# Altium project radxa_c200_io_board_v1.11.PrjPcb (part 4 of 8)

## Sheet 11_USB3.1 x4 HUB.SchDoc: C200
size 439 x 311 mm; Page Create Date: March  8, 1995; Page Number: 11; Page Size: Custom; Comment: radxa_1010; Page Count: 21; RevCode: V1.11; Doc: 11_USB3.1 x4 HUB; DsnPath: D:\WMS\C200\CC122\对外\C200 V1.11.DSN; SchematicName: c200; PageName: 11_USB3.1 x4 HUB; PageSize: Custom; TopSchematic: True
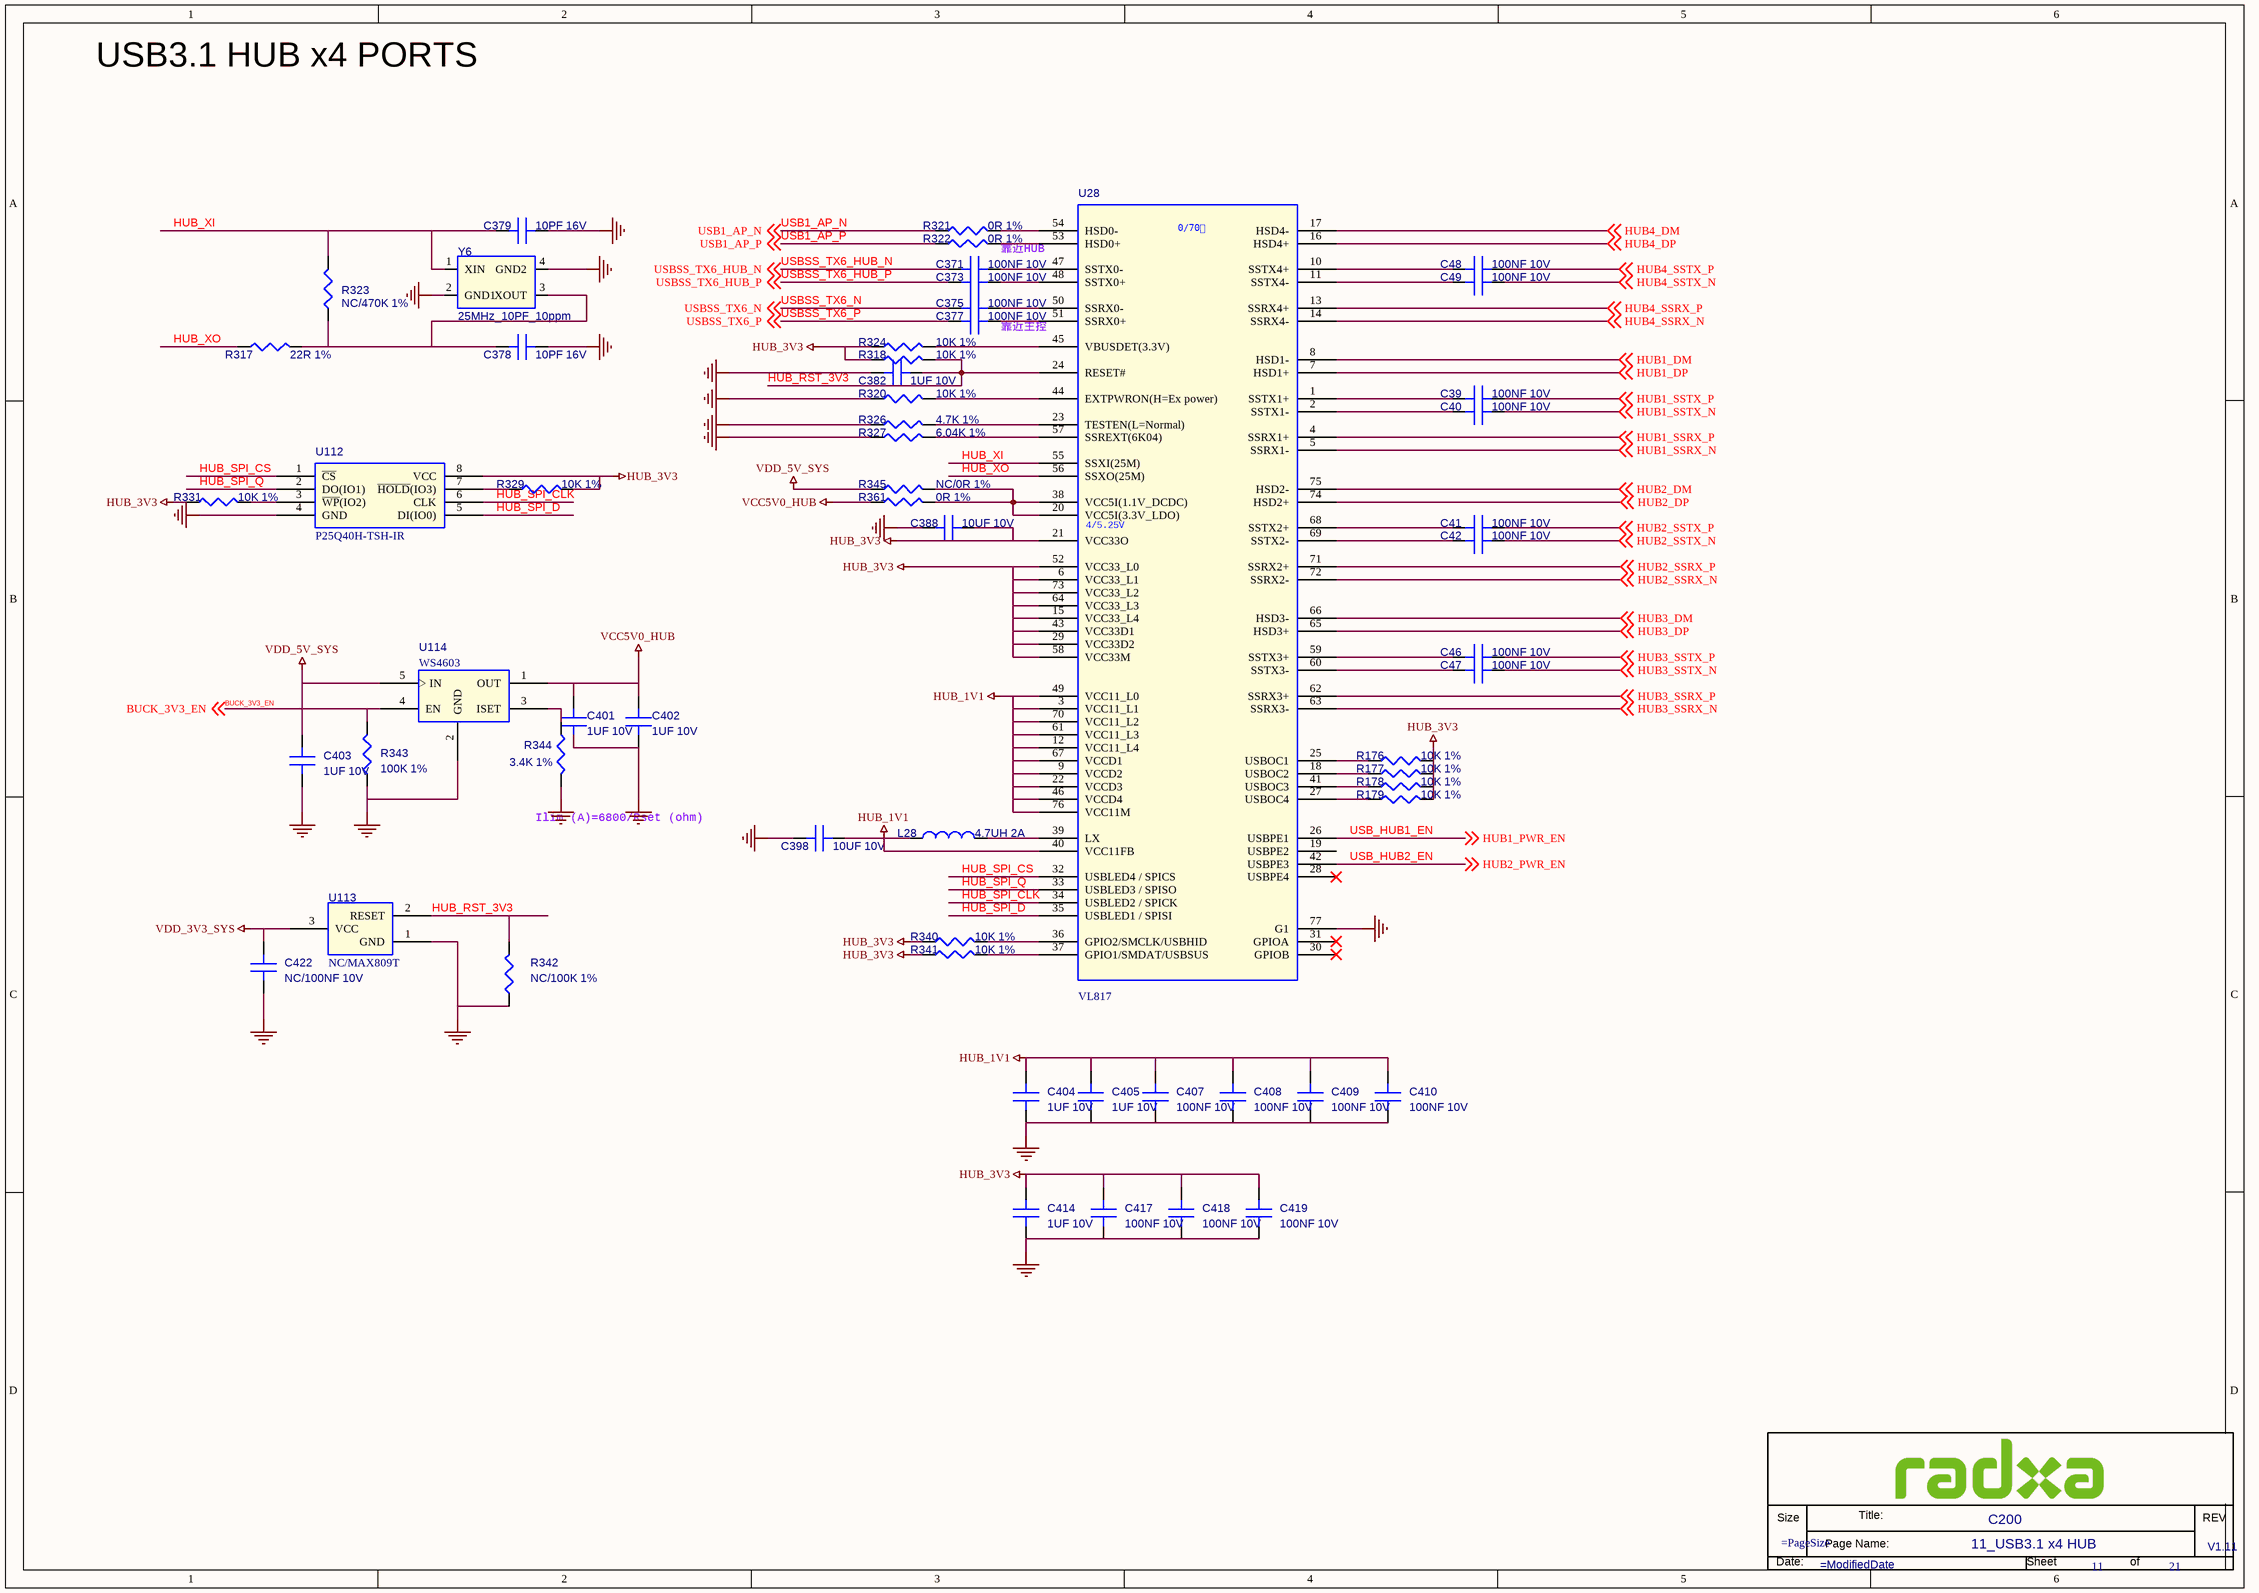
[diagram p23: 11_USB3.1 x4 HUB.SchDoc]

### Parts
(Parts that share a designator on the sheet are numbered #1, #2 ... from top to bottom, then left to right.)
*#10  Doc: 11_USB3.1 x4 HUB  RevCode: V1.11  Title: C200  Page Number: 11  Page Count: 21  (hidden comment: radxa_1010)  (graphical)
C39  100NF 10V  [C0402]
C40  100NF 10V  [C0402]
C41  100NF 10V  [C0402]
C42  100NF 10V  [C0402]
C46  100NF 10V  [C0402]
C47  100NF 10V  [C0402]
C48  100NF 10V  [C0402]
C49  100NF 10V  [C0402]
C371  100NF 10V  [C0402]
C373  100NF 10V  [C0402]
C375  100NF 10V  [C0402]
C377  100NF 10V  [C0402]
C378  10PF 16V  [C0402]
C379  10PF 16V  [C0402]
C382  1UF 10V  [C0402]
C388  10UF 10V  [C0603]
C398  10UF 10V  [C0603]
C401  1UF 10V  [C0402]
C402  1UF 10V  [C0402]
C403  1UF 10V  [C0402]
C404  1UF 10V  [C0402]
C405  1UF 10V  [C0402]
C407  100NF 10V  [C0402]
C408  100NF 10V  [C0402]
C409  100NF 10V  [C0402]
C410  100NF 10V  [C0402]
C414  1UF 10V  [C0402]
C417  100NF 10V  [C0402]
C418  100NF 10V  [C0402]
C419  100NF 10V  [C0402]
C422  NC/100NF 10V  [C0402]
L28  4.7UH 2A  [L_2520]
R176  10K 1%  [R0402]
R177  10K 1%  [R0402]
R178  10K 1%  [R0402]
R179  10K 1%  [R0402]
R317  22R 1%  [R0402]
R318  10K 1%  [R0402]
R320  10K 1%  [R0402]
R321  0R 1%  [R0402]
R322  0R 1%  [R0402]
R323  NC/470K 1%  [R0402]
R324  10K 1%  [R0402]
R326  4.7K 1%  [R0402]
R327  6.04K 1%  [R0402]
R329  10K 1%  [R0402]
R331  10K 1%  [R0402]
R340  10K 1%  [R0402]
R341  10K 1%  [R0402]
R342  NC/100K 1%  [R0402]
R343  100K 1%  [R0402]
R344  3.4K 1%  [R0402]
R345  NC/0R 1%  [R0402]
R361  0R 1%  [R0402]
U28  VL817  [QFN76E-PH04-9x9mm]
U112  P25Q40H-TSH-IR  [TSSOP8_0D65_4]
U113  NC/MAX809T  [SOT_23]
U114  WS4603  [SOT23_5]
Y6  25MHz_10PF_10ppm  [CRY-3225]

### Nets
GND: C378.1(A) C379.1(A) C382.1(A) C388.2(B) C398.2(B) C401.2(B) C402.2(B) C403.1(A) C404.2(B) C405.2(B) C407.2(B) C408.2(B) C409.2(B) C410.2(B) C414.2(B) C417.2(B) C418.2(B) C419.2(B) C422.2(B) R320.2 R326.2 R327.2 R342.2 R343.1 R344.1 U28.77(G1) U112.4(GND) U113.1(GND) U114.2(GND) Y6.2(GND1) Y6.4(GND2)  [project net HUB2_SSTX_N_J25]
HUB_1V1: C398.1(A) C404.1(A) C405.1(A) C407.1(A) C408.1(A) C409.1(A) C410.1(A) L28.1 U28.3(VCC11_L1) U28.9(VCCD2) U28.12(VCC11_L4) U28.22(VCCD3) U28.40(VCC11FB) U28.46(VCCD4) U28.49(VCC11_L0) U28.61(VCC11_L3) U28.67(VCCD1) U28.70(VCC11_L2) U28.76(VCC11M)
HUB_3V3: C388.1(A) C414.1(A) C417.1(A) C418.1(A) C419.1(A) R176.2 R177.2 R178.2 R179.2 R318.2 R324.2 R329.1 R331.2 R340.2 R341.2 U28.6(VCC33_L1) U28.15(VCC33_L4) U28.21(VCC33O) U28.29(VCC33D2) U28.43(VCC33D1) U28.52(VCC33_L0) U28.58(VCC33M) U28.64(VCC33_L3) U28.73(VCC33_L2) U112.8(VCC)
VCC5V0_HUB: C401.1(A) C402.1(A) R361.2 U114.1(OUT)
VDD_3V3_SYS: C422.1(A) U113.3(VCC)  [project net 3V3]
VDD_5V_SYS: C403.2(B) R345.2 U114.5(IN)  [project net PC_LED+]
BUCK_3V3_EN: R343.2 U114.4(EN) ; off-sheet BUCK_3V3_EN
HUB1_DM: U28.8(HSD1-) ; off-sheet HUB1_DM
HUB1_DP: U28.7(HSD1+) ; off-sheet HUB1_DP
HUB1_PWR_EN: U28.26(USBPE1) ; off-sheet HUB1_PWR_EN  [also labelled USB_HUB1_EN]
HUB1_SSRX_N: U28.5(SSRX1-) ; off-sheet HUB1_SSRX_N
HUB1_SSRX_P: U28.4(SSRX1+) ; off-sheet HUB1_SSRX_P
HUB1_SSTX_N: C40.2(B) ; off-sheet HUB1_SSTX_N
HUB1_SSTX_P: C39.2(B) ; off-sheet HUB1_SSTX_P
HUB2_DM: U28.75(HSD2-) ; off-sheet HUB2_DM
HUB2_DP: U28.74(HSD2+) ; off-sheet HUB2_DP
HUB2_PWR_EN: U28.42(USBPE3) ; off-sheet HUB2_PWR_EN  [also labelled USB_HUB2_EN]
HUB2_SSRX_N: U28.72(SSRX2-) ; off-sheet HUB2_SSRX_N
HUB2_SSRX_P: U28.71(SSRX2+) ; off-sheet HUB2_SSRX_P
HUB2_SSTX_N: C42.2(B) ; off-sheet HUB2_SSTX_N
HUB2_SSTX_P: C41.2(B) ; off-sheet HUB2_SSTX_P
HUB3_DM: U28.66(HSD3-) ; off-sheet HUB3_DM
HUB3_DP: U28.65(HSD3+) ; off-sheet HUB3_DP
HUB3_SSRX_N: U28.63(SSRX3-) ; off-sheet HUB3_SSRX_N
HUB3_SSRX_P: U28.62(SSRX3+) ; off-sheet HUB3_SSRX_P
HUB3_SSTX_N: C47.2(B) ; off-sheet HUB3_SSTX_N
HUB3_SSTX_P: C46.2(B) ; off-sheet HUB3_SSTX_P
HUB4_DM: U28.17(HSD4-) ; off-sheet HUB4_DM
HUB4_DP: U28.16(HSD4+) ; off-sheet HUB4_DP
HUB4_SSRX_N: U28.14(SSRX4-) ; off-sheet HUB4_SSRX_N
HUB4_SSRX_P: U28.13(SSRX4+) ; off-sheet HUB4_SSRX_P
HUB4_SSTX_N: C49.2(B) ; off-sheet HUB4_SSTX_N
HUB4_SSTX_P: C48.2(B) ; off-sheet HUB4_SSTX_P
HUB_RST_3V3: C382.2(B) R318.1 R342.1 U28.24(RESET#) U113.2(RESET)
HUB_SPI_CLK: U28.34(USBLED2_/_SPICK) U112.6(CLK)
HUB_SPI_CS: U28.32(USBLED4_/_SPICS) U112.1(~{CS})
HUB_SPI_D: U28.35(USBLED1_/_SPISI) U112.5(DI(IO0))
HUB_SPI_Q: U28.33(USBLED3_/_SPISO) U112.2(DO(IO1))
HUB_XI: C379.2(B) R323.1 U28.55(SSXI(25M)) Y6.1(XIN)
HUB_XO: R317.2 U28.56(SSXO(25M))
USB1_AP_N: R321.2 ; off-sheet USB1_AP_N
USB1_AP_P: R322.2 ; off-sheet USB1_AP_P
USBSS_TX6_HUB_N: C371.2(B) ; off-sheet USBSS_TX6_HUB_N
USBSS_TX6_HUB_P: C373.2(B) ; off-sheet USBSS_TX6_HUB_P
USBSS_TX6_N: C375.2(B) ; off-sheet USBSS_TX6_N
USBSS_TX6_P: C377.2(B) ; off-sheet USBSS_TX6_P
NetC39_1: C39.1(A) U28.1(SSTX1+)
NetC40_1: C40.1(A) U28.2(SSTX1-)
NetC41_1: C41.1(A) U28.68(SSTX2+)
NetC42_1: C42.1(A) U28.69(SSTX2-)
NetC46_1: C46.1(A) U28.59(SSTX3+)
NetC47_1: C47.1(A) U28.60(SSTX3-)
NetC48_1: C48.1(A) U28.10(SSTX4+)
NetC49_1: C49.1(A) U28.11(SSTX4-)
NetC371_1: C371.1(A) U28.47(SSTX0-)
NetC373_1: C373.1(A) U28.48(SSTX0+)
NetC375_1: C375.1(A) U28.50(SSRX0-)
NetC377_1: C377.1(A) U28.51(SSRX0+)
NetC378_2: C378.2(B) R317.1 R323.2 Y6.3(XOUT)
NetL28_2: L28.2 U28.39(LX)
NetR176_1: R176.1 U28.25(USBOC1)
NetR177_1: R177.1 U28.18(USBOC2)
NetR178_1: R178.1 U28.41(USBOC3)
NetR179_1: R179.1 U28.27(USBOC4)
NetR320_1: R320.1 U28.44(EXTPWRON(H=Ex_power))
NetR321_1: R321.1 U28.54(HSD0-)
NetR322_1: R322.1 U28.53(HSD0+)
NetR324_1: R324.1 U28.45(VBUSDET(3.3V))
NetR326_1: R326.1 U28.23(TESTEN(L=Normal))
NetR327_1: R327.1 U28.57(SSREXT(6K04))
NetR329_2: R329.2 U112.7(~{HOLD}(IO3))
NetR331_1: R331.1 U112.3(~{WP}(IO2))
NetR340_1: R340.1 U28.36(GPIO2/SMCLK/USBHID)
NetR341_1: R341.1 U28.37(GPIO1/SMDAT/USBSUS)
NetR344_2: R344.2 U114.3(ISET)
NetR345_1: R345.1 R361.1 U28.20(VCC5I(3.3V_LDO)) U28.38(VCC5I(1.1V_DCDC))

Not connected (* = marked no-connect by the designer): U28 19(USBPE2) 28(USBPE4)* 30(GPIOB)* 31(GPIOA)*

### Notes on the sheet
- USB3.1 HUB x4 PORTS
- 靠近HUB
- 靠近主控
- (near R344) Ilim (A)=6800/Rset (ohm)
- (in symbol radxa_1010) Size; Title:; REV; Page Name:; Date:; Sheet; of
- (in symbol VL817) 0/70℃; 4/5.25V

### Library data of the parts
C39 = C: SMD  0402  100NF  10V  X5R  ±10%  ROHS; PARTS: 1; Part Reference: C39; Part Number: A1C01.00163; OriginalSymbolOrigin: (0,30); PKG_TYPE: CAP2-100-250; LEVEL: STD; PINSWAP: (A,B); Value: 100NF 10V; Part Type: 陶瓷电容; PCB Footprint: C0402
C40 = C: SMD  0402  100NF  10V  X5R  ±10%  ROHS; PARTS: 1; Part Reference: C40; Part Number: A1C01.00163; OriginalSymbolOrigin: (0,30); PKG_TYPE: CAP2-100-250; LEVEL: STD; PINSWAP: (A,B); Value: 100NF 10V; Part Type: 陶瓷电容; PCB Footprint: C0402
C41 = C: SMD  0402  100NF  10V  X5R  ±10%  ROHS; PARTS: 1; Part Reference: C41; Part Number: A1C01.00163; OriginalSymbolOrigin: (0,30); PKG_TYPE: CAP2-100-250; LEVEL: STD; PINSWAP: (A,B); Value: 100NF 10V; Part Type: 陶瓷电容; PCB Footprint: C0402
C42 = C: SMD  0402  100NF  10V  X5R  ±10%  ROHS; PARTS: 1; Part Reference: C42; Part Number: A1C01.00163; OriginalSymbolOrigin: (0,30); PKG_TYPE: CAP2-100-250; LEVEL: STD; PINSWAP: (A,B); Value: 100NF 10V; Part Type: 陶瓷电容; PCB Footprint: C0402
C46 = C: SMD  0402  100NF  10V  X5R  ±10%  ROHS; PARTS: 1; Part Reference: C46; Part Number: A1C01.00163; OriginalSymbolOrigin: (0,30); PKG_TYPE: CAP2-100-250; LEVEL: STD; PINSWAP: (A,B); Value: 100NF 10V; Part Type: 陶瓷电容; PCB Footprint: C0402
C47 = C: SMD  0402  100NF  10V  X5R  ±10%  ROHS; PARTS: 1; Part Reference: C47; Part Number: A1C01.00163; OriginalSymbolOrigin: (0,30); PKG_TYPE: CAP2-100-250; LEVEL: STD; PINSWAP: (A,B); Value: 100NF 10V; Part Type: 陶瓷电容; PCB Footprint: C0402
C48 = C: SMD  0402  100NF  10V  X5R  ±10%  ROHS; PARTS: 1; Part Reference: C48; Part Number: A1C01.00163; OriginalSymbolOrigin: (0,30); PKG_TYPE: CAP2-100-250; LEVEL: STD; PINSWAP: (A,B); Value: 100NF 10V; Part Type: 陶瓷电容; PCB Footprint: C0402
C49 = C: SMD  0402  100NF  10V  X5R  ±10%  ROHS; PARTS: 1; Part Reference: C49; Part Number: A1C01.00163; OriginalSymbolOrigin: (0,30); PKG_TYPE: CAP2-100-250; LEVEL: STD; PINSWAP: (A,B); Value: 100NF 10V; Part Type: 陶瓷电容; PCB Footprint: C0402
C371 = C: SMD  0402  100NF  10V  X5R  ±10%  ROHS; PARTS: 1; Part Reference: C371; Part Number: A1C01.00163; OriginalSymbolOrigin: (0,30); PKG_TYPE: CAP2-100-250; LEVEL: STD; PINSWAP: (A,B); Value: 100NF 10V; Part Type: 陶瓷电容; PCB Footprint: C0402
C373 = C: SMD  0402  100NF  10V  X5R  ±10%  ROHS; PARTS: 1; Part Reference: C373; Part Number: A1C01.00163; OriginalSymbolOrigin: (0,30); PKG_TYPE: CAP2-100-250; LEVEL: STD; PINSWAP: (A,B); Value: 100NF 10V; Part Type: 陶瓷电容; PCB Footprint: C0402
C375 = C: SMD  0402  100NF  10V  X5R  ±10%  ROHS; PARTS: 1; Part Reference: C375; Part Number: A1C01.00163; OriginalSymbolOrigin: (0,30); PKG_TYPE: CAP2-100-250; LEVEL: STD; PINSWAP: (A,B); Value: 100NF 10V; Part Type: 陶瓷电容; PCB Footprint: C0402
C377 = C: SMD  0402  100NF  10V  X5R  ±10%  ROHS; PARTS: 1; Part Reference: C377; Part Number: A1C01.00163; OriginalSymbolOrigin: (0,30); PKG_TYPE: CAP2-100-250; LEVEL: STD; PINSWAP: (A,B); Value: 100NF 10V; Part Type: 陶瓷电容; PCB Footprint: C0402
C378 = C: SMD  0402  10PF  16V  NPO  ±10%  ROHS; PARTS: 1; Part Reference: C378; Part Number: A1C01.00152; OriginalSymbolOrigin: (0,30); PKG_TYPE: CAP2-100-250; LEVEL: STD; PINSWAP: (A,B); Value: 10PF 16V; Part Type: 陶瓷电容; PCB Footprint: C0402
C379 = C: SMD  0402  10PF  16V  NPO  ±10%  ROHS; PARTS: 1; Part Reference: C379; Part Number: A1C01.00152; OriginalSymbolOrigin: (0,30); PKG_TYPE: CAP2-100-250; LEVEL: STD; PINSWAP: (A,B); Value: 10PF 16V; Part Type: 陶瓷电容; PCB Footprint: C0402
C382 = C: SMD  0402  1UF  10V  X5R  ±10%  ROHS; PARTS: 1; Part Reference: C382; Part Number: A1C01.00063; OriginalSymbolOrigin: (0,30); PKG_TYPE: CAP2-100-250; LEVEL: STD; PINSWAP: (A,B); Value: 1UF 10V; Part Type: 陶瓷电容; PCB Footprint: C0402
C388 = C: SMD  0603  10UF  10V  X5R  ±10%  ROHS; PARTS: 1; Part Reference: C388; Part Number: A1C01.00270; OriginalSymbolOrigin: (0,30); PKG_TYPE: CAP2-100-250; LEVEL: STD; PINSWAP: (A,B); Value: 10UF 10V; Part Type: 陶瓷电容; PCB Footprint: C0603
C398 = C: SMD  0603  10UF  10V  X5R  ±10%  ROHS; PARTS: 1; Part Reference: C398; Part Number: A1C01.00270; OriginalSymbolOrigin: (0,30); PKG_TYPE: CAP2-100-250; LEVEL: STD; PINSWAP: (A,B); Value: 10UF 10V; Part Type: 陶瓷电容; PCB Footprint: C0603
C401 = C: SMD  0402  1UF  10V  X5R  ±10%  ROHS; PARTS: 1; Part Reference: C401; Part Number: A1C01.00063; OriginalSymbolOrigin: (0,30); PKG_TYPE: CAP2-100-250; LEVEL: STD; PINSWAP: (A,B); Value: 1UF 10V; Part Type: 陶瓷电容; PCB Footprint: C0402
C402 = C: SMD  0402  1UF  10V  X5R  ±10%  ROHS; PARTS: 1; Part Reference: C402; Part Number: A1C01.00063; OriginalSymbolOrigin: (0,30); PKG_TYPE: CAP2-100-250; LEVEL: STD; PINSWAP: (A,B); Value: 1UF 10V; Part Type: 陶瓷电容; PCB Footprint: C0402
C403 = C: SMD  0402  1UF  10V  X5R  ±10%  ROHS; PARTS: 1; Part Reference: C403; Part Number: A1C01.00063; OriginalSymbolOrigin: (0,30); PKG_TYPE: CAP2-100-250; LEVEL: STD; PINSWAP: (A,B); Value: 1UF 10V; Part Type: 陶瓷电容; PCB Footprint: C0402
C404 = C: SMD  0402  1UF  10V  X5R  ±10%  ROHS; PARTS: 1; Part Reference: C404; Part Number: A1C01.00063; OriginalSymbolOrigin: (0,30); PKG_TYPE: CAP2-100-250; LEVEL: STD; PINSWAP: (A,B); Value: 1UF 10V; Part Type: 陶瓷电容; PCB Footprint: C0402
C405 = C: SMD  0402  1UF  10V  X5R  ±10%  ROHS; PARTS: 1; Part Reference: C405; Part Number: A1C01.00063; OriginalSymbolOrigin: (0,30); PKG_TYPE: CAP2-100-250; LEVEL: STD; PINSWAP: (A,B); Value: 1UF 10V; Part Type: 陶瓷电容; PCB Footprint: C0402
C407 = C: SMD  0402  100NF  10V  X5R  ±10%  ROHS; PARTS: 1; Part Reference: C407; Part Number: A1C01.00163; OriginalSymbolOrigin: (0,30); PKG_TYPE: CAP2-100-250; LEVEL: STD; PINSWAP: (A,B); Value: 100NF 10V; Part Type: 陶瓷电容; PCB Footprint: C0402
C408 = C: SMD  0402  100NF  10V  X5R  ±10%  ROHS; PARTS: 1; Part Reference: C408; Part Number: A1C01.00163; OriginalSymbolOrigin: (0,30); PKG_TYPE: CAP2-100-250; LEVEL: STD; PINSWAP: (A,B); Value: 100NF 10V; Part Type: 陶瓷电容; PCB Footprint: C0402
C409 = C: SMD  0402  100NF  10V  X5R  ±10%  ROHS; PARTS: 1; Part Reference: C409; Part Number: A1C01.00163; OriginalSymbolOrigin: (0,30); PKG_TYPE: CAP2-100-250; LEVEL: STD; PINSWAP: (A,B); Value: 100NF 10V; Part Type: 陶瓷电容; PCB Footprint: C0402
C410 = C: SMD  0402  100NF  10V  X5R  ±10%  ROHS; PARTS: 1; Part Reference: C410; Part Number: A1C01.00163; OriginalSymbolOrigin: (0,30); PKG_TYPE: CAP2-100-250; LEVEL: STD; PINSWAP: (A,B); Value: 100NF 10V; Part Type: 陶瓷电容; PCB Footprint: C0402
C414 = C: SMD  0402  1UF  10V  X5R  ±10%  ROHS; PARTS: 1; Part Reference: C414; Part Number: A1C01.00063; OriginalSymbolOrigin: (0,30); PKG_TYPE: CAP2-100-250; LEVEL: STD; PINSWAP: (A,B); Value: 1UF 10V; Part Type: 陶瓷电容; PCB Footprint: C0402
C417 = C: SMD  0402  100NF  10V  X5R  ±10%  ROHS; PARTS: 1; Part Reference: C417; Part Number: A1C01.00163; OriginalSymbolOrigin: (0,30); PKG_TYPE: CAP2-100-250; LEVEL: STD; PINSWAP: (A,B); Value: 100NF 10V; Part Type: 陶瓷电容; PCB Footprint: C0402
C418 = C: SMD  0402  100NF  10V  X5R  ±10%  ROHS; PARTS: 1; Part Reference: C418; Part Number: A1C01.00163; OriginalSymbolOrigin: (0,30); PKG_TYPE: CAP2-100-250; LEVEL: STD; PINSWAP: (A,B); Value: 100NF 10V; Part Type: 陶瓷电容; PCB Footprint: C0402
C419 = C: SMD  0402  100NF  10V  X5R  ±10%  ROHS; PARTS: 1; Part Reference: C419; Part Number: A1C01.00163; OriginalSymbolOrigin: (0,30); PKG_TYPE: CAP2-100-250; LEVEL: STD; PINSWAP: (A,B); Value: 100NF 10V; Part Type: 陶瓷电容; PCB Footprint: C0402
C422 = C: SMD  0402  100NF  10V  X5R  ±10%  ROHS; PARTS: 1; Part Reference: C422; Part Number: A1C01.00163; OriginalSymbolOrigin: (0,30); PKG_TYPE: CAP2-100-250; LEVEL: STD; PINSWAP: (A,B); Value: NC/100NF 10V; Part Type: 陶瓷电容; PCB Footprint: C0402
L28 = L: SMD  带屏蔽  2.5*2.0*1.0mm  4.7UH  2A  ±20%  FTC252010S4R7MBCA  cjiang(长江微电)  ROHS; Part Reference: L28; Part Number: A1L01.00169; PCB Footprint: L_2520; Value: 4.7UH 2A; Part Type: 贴片功率电感
R176 = R: SMD  0201  10K  1/20W  ±1%  ROHS; Part Reference: R176; Part Number: A1R01.00060; PCB Footprint: R0201; Preferred: 优选; Value: 10K 1%; Part Type: 贴片电阻
R177 = R: SMD  0201  10K  1/20W  ±1%  ROHS; Part Reference: R177; Part Number: A1R01.00060; PCB Footprint: R0201; Preferred: 优选; Value: 10K 1%; Part Type: 贴片电阻
R178 = R: SMD  0201  10K  1/20W  ±1%  ROHS; Part Reference: R178; Part Number: A1R01.00060; PCB Footprint: R0201; Preferred: 优选; Value: 10K 1%; Part Type: 贴片电阻
R179 = R: SMD  0201  10K  1/20W  ±1%  ROHS; Part Reference: R179; Part Number: A1R01.00060; PCB Footprint: R0201; Preferred: 优选; Value: 10K 1%; Part Type: 贴片电阻
R317 = R: SMD  0402  22R  1/16W  ±1%  ROHS; Part Reference: R317; Part Number: A1R01.00408; PCB Footprint: R0402; Value: 22R 1%; Part Type: 贴片电阻
R318 = R: SMD  0402  10K  1/16W  ±1%  ROHS; Part Reference: R318; Part Number: A1R01.00222; PCB Footprint: R0402; Value: 10K 1%; Part Type: 贴片电阻
R320 = R: SMD  0402  10K  1/16W  ±1%  ROHS; Part Reference: R320; Part Number: A1R01.00222; PCB Footprint: R0402; Value: 10K 1%; Part Type: 贴片电阻
R321 = R: SMD  0402  0R  1/16W  ±1%  ROHS; Part Reference: R321; Part Number: A1R01.00219; PCB Footprint: R0402; Value: 0R 1%; Part Type: 贴片电阻
R322 = R: SMD  0402  0R  1/16W  ±1%  ROHS; Part Reference: R322; Part Number: A1R01.00219; PCB Footprint: R0402; Value: 0R 1%; Part Type: 贴片电阻
R323 = R: SMD  0402  470K  1/16W  ±1%  ROHS; Part Reference: R323; Part Number: A1R01.00305; PCB Footprint: R0402; Value: NC/470K 1%; Part Type: 贴片电阻
R324 = R: SMD  0402  10K  1/16W  ±1%  ROHS; Part Reference: R324; Part Number: A1R01.00222; PCB Footprint: R0402; Value: 10K 1%; Part Type: 贴片电阻
R326 = R: SMD  0402  4.7K  1/16W  ±1%  ROHS; Part Reference: R326; Part Number: A1R01.00250; PCB Footprint: R0402; Value: 4.7K 1%; Part Type: 贴片电阻
R327 = R: SMD  0402  6.04K  1/20W  ±1%  ROHS; Part Reference: R327; Part Number: A1R01.00515; Temp Coeff: -55℃~+155℃; PCB Footprint: R0402; Value: 6.04K 1%; Part Type: 贴片电阻
R329 = R: SMD  0402  10K  1/16W  ±1%  ROHS; Part Reference: R329; Part Number: A1R01.00222; PCB Footprint: R0402; Value: 10K 1%; Part Type: 贴片电阻
R331 = R: SMD  0402  10K  1/16W  ±1%  ROHS; Part Reference: R331; Part Number: A1R01.00222; PCB Footprint: R0402; Value: 10K 1%; Part Type: 贴片电阻
R340 = R: SMD  0402  10K  1/16W  ±1%  ROHS; Part Reference: R340; Part Number: A1R01.00222; PCB Footprint: R0402; Value: 10K 1%; Part Type: 贴片电阻
R341 = R: SMD  0402  10K  1/16W  ±1%  ROHS; Part Reference: R341; Part Number: A1R01.00222; PCB Footprint: R0402; Value: 10K 1%; Part Type: 贴片电阻
R342 = R: SMD  0402  100K  1/16W  ±1%  ROHS; Part Reference: R342; Part Number: A1R01.00031; Temp Coeff: －55℃ ~ ＋155℃; PCB Footprint: R0402; Value: NC/100K 1%; Part Type: 贴片电阻
R343 = R: SMD  0402  100K  1/16W  ±1%  ROHS; Part Reference: R343; Part Number: A1R01.00031; Temp Coeff: －55℃ ~ ＋155℃; PCB Footprint: R0402; Value: 100K 1%; Part Type: 贴片电阻
R344 = R: SMD  0402  3.4K  1/16W  ±1%  ROHS; Part Reference: R344; Part Number: A1R01.00506; PCB Footprint: R0402; Value: 3.4K 1%; Part Type: 贴片电阻
R345 = R: SMD  0402  0R  1/16W  ±1%  ROHS; Part Reference: R345; Part Number: A1R01.00219; PCB Footprint: R0402; Value: NC/0R 1%; Part Type: 贴片电阻
R361 = R: SMD  0402  0R  1/16W  ±1%  ROHS; Part Reference: R361; Part Number: A1R01.00219; PCB Footprint: R0402; Value: 0R 1%; Part Type: 贴片电阻
U28 = VL817: SMD  USB 3.1 四端口输入  VL817  第1代集线器控制器  QFN76  VIA Technologies(威盛)  ROHS; Part Reference: U28; Part Number: A1I01.00687; Parameter: USB3.0 HUB芯片-VL817 QFN76; PCB Footprint: QFN76_0D4_9; Value: VL817; Part Type: 集成电路/模块
U112 = P25Q40H_TSH_IR: SMD  Flash  P25Q40H-TSH-IR  4Mb  2.3V~3.6V  TSSOP-8  PUYA(普冉)  ROHS; Part Reference: U112; Part Number: A1I01.00693; Parameter: SPI flash-比派USB HUB芯片配套flash P25Q40H; Temp Coeff: -40°C to +85°C; Value: P25Q40H-TSH-IR; Part Type: 集成电路/模块; PCB Footprint: TSSOP8_0D65_4
U113 = MAX809T: SMD  复位芯片  MAX809T  低电平有效,阈值电压3.08V,VIN 5.5V  SOT-23  UMW(友台半导体)  ROHS; Part Reference: U113; Part Number: A1I01.00764; Temp Coeff: -40℃~85℃; Value: NC/MAX809T; Part Type: 集成电路/模块; PCB Footprint: SOT_23
U114 = WS4603: SMD  功率开关  WS4603E-5/TR  1.25H  SOT-23-5L  ROHS; Part Reference: U114; Part Number: A1I01.00241; Parameter: SOT23-5; ID: U-IC0020; Temp Coeff: -40℃ to 85℃; Value: WS4603; Part Type: 集成电路/模块; PCB Footprint: SOT23_5
Y6 = OSC_4P: SMD编带  无源  3225  25MHz  10PF  ±10ppm  ROHS; Part Reference: Y6; Part Number: A1Y01.00017; PCB Footprint: OSC_SM4_3D2X2D5; Value: 25MHz_10PF_10ppm; Part Type: 晶振
*#10 = radxa_1010: Page Create Date: March  8, 1995; Page Size: =PageSize; Page Modify Date: =ModifiedDate

## Sheet 12_USB3.1 Type-A x2 (A).SchDoc: C200
size 439 x 311 mm; Page Create Date: March  8, 1995; Page Number: 12; Page Size: Custom; Comment: radxa_1010; Page Count: 21; RevCode: V1.11; Doc: 12_USB3.1 Type-A x2 (A); DsnPath: D:\WMS\C200\CC122\对外\C200 V1.11.DSN; SchematicName: c200; PageName: 12_USB3.1 Type-A x2 (A); PageSize: Custom; TopSchematic: True
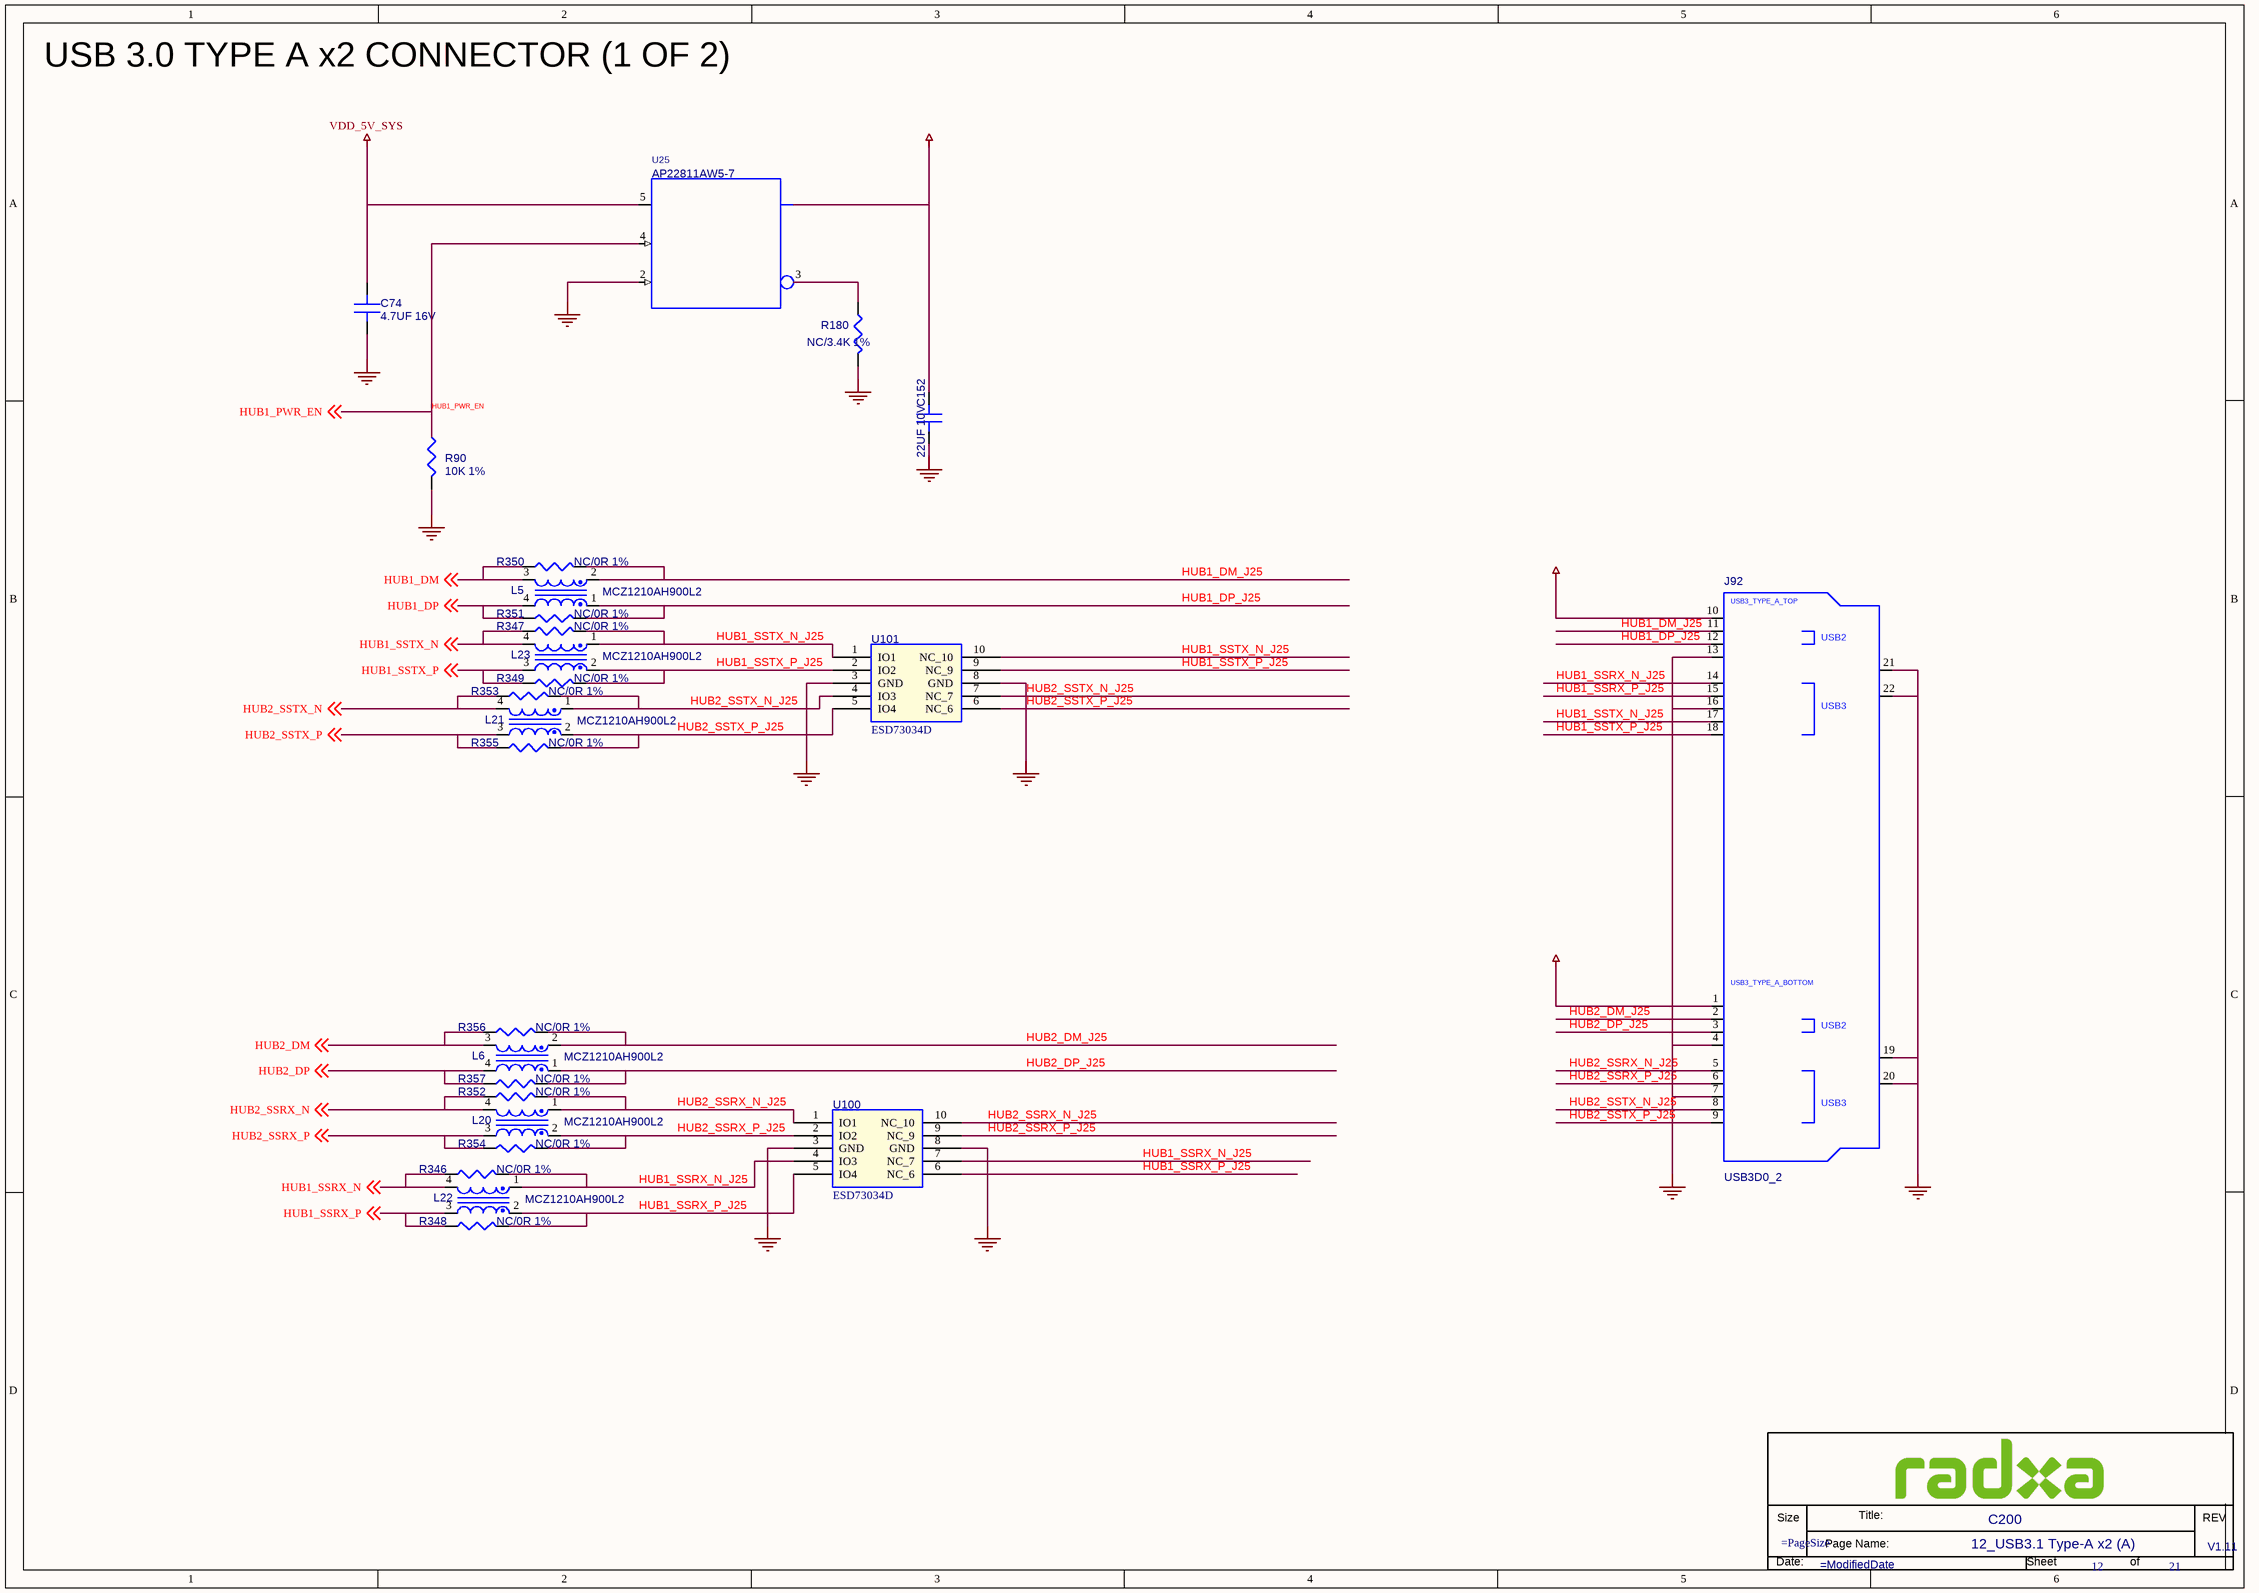
[diagram p24: 12_USB3.1 Type-A x2 (A).SchDoc]

### Parts
(Parts that share a designator on the sheet are numbered #1, #2 ... from top to bottom, then left to right.)
*#11  Doc: 12_USB3.1 Type-A x2 (A)  RevCode: V1.11  Title: C200  Page Number: 12  Page Count: 21  (hidden comment: radxa_1010)  (graphical)
C74  4.7UF 16V  [C0603]
C152  22UF 10V  [C0603]
J92  USB3D0_2  [USB3_TH18_17D0X14D0_LIE]
L5  MCZ1210AH900L2  [LC1210]
L6  MCZ1210AH900L2  [LC1210]
L20  MCZ1210AH900L2  [LC1210]
L21  MCZ1210AH900L2  [LC1210]
L22  MCZ1210AH900L2  [LC1210]
L23  MCZ1210AH900L2  [LC1210]
R90  10K 1%  [R0402]
R180  NC/3.4K 1%  [R0402]
R346  NC/0R 1%  [R0402]
R347  NC/0R 1%  [R0402]
R348  NC/0R 1%  [R0402]
R349  NC/0R 1%  [R0402]
R350  NC/0R 1%  [R0402]
R351  NC/0R 1%  [R0402]
R352  NC/0R 1%  [R0402]
R353  NC/0R 1%  [R0402]
R354  NC/0R 1%  [R0402]
R355  NC/0R 1%  [R0402]
R356  NC/0R 1%  [R0402]
R357  NC/0R 1%  [R0402]
U25  AP22811AW5-7  [SOT23_5]
U100  ESD73034D  [XSON10_0D5_1D1X2D6]
U101  ESD73034D  [XSON10_0D5_1D1X2D6]

### Nets
HUB2_SSTX_N_J25: C74.2(B) C152.2(B) J92.4(GND1) J92.7(GND2) J92.8(SSTXN0) J92.9(SSTXP0) J92.13(GND3) J92.16(GND4) J92.19(MT1) J92.20(MT2) J92.21(MT3) J92.22(MT4) L21.1 L21.2 R90.2 R180.1 R353.2 R355.2 U25.2(GND) U100.3(GND) U100.8(GND) U101.3(GND) U101.4(IO3) U101.5(IO4) U101.6(NC_6) U101.7(NC_7) U101.8(GND)  [also labelled GND, HUB2_SSTX_P_J25]
OUT: U25.1(OUT)
VDD_5V_SYS: C74.1(A) U25.5(IN)  [project net PC_LED+]
VDD_USB_VBUSTYPEA: C152.1(A) J92.1(VBUS0) J92.10(VBUS1)
HUB1_DM: L5.3 R350.1 ; off-sheet HUB1_DM
HUB1_DM_J25: J92.11(DN1) L5.2 R350.2
HUB1_DP: L5.4 R351.1 ; off-sheet HUB1_DP
HUB1_DP_J25: J92.12(DP1) L5.1 R351.2
HUB1_PWR_EN: R90.1 U25.4(EN) ; off-sheet HUB1_PWR_EN
HUB1_SSRX_N: L22.4 R346.1 ; off-sheet HUB1_SSRX_N
HUB1_SSRX_N_J25: J92.14(SSRXN1) L22.1 R346.2 U100.4(IO3) U100.7(NC_7)
HUB1_SSRX_P: L22.3 R348.1 ; off-sheet HUB1_SSRX_P
HUB1_SSRX_P_J25: J92.15(SSRXP1) L22.2 R348.2 U100.5(IO4) U100.6(NC_6)
HUB1_SSTX_N: L23.4 R347.1 ; off-sheet HUB1_SSTX_N
HUB1_SSTX_N_J25: J92.17(SSTXN1) L23.1 R347.2 U101.1(IO1) U101.10(NC_10)
HUB1_SSTX_P: L23.3 R349.1 ; off-sheet HUB1_SSTX_P
HUB1_SSTX_P_J25: J92.18(SSTXP1) L23.2 R349.2 U101.2(IO2) U101.9(NC_9)
HUB2_DM: L6.3 R356.1 ; off-sheet HUB2_DM
HUB2_DM_J25: J92.2(DN0) L6.2 R356.2
HUB2_DP: L6.4 R357.1 ; off-sheet HUB2_DP
HUB2_DP_J25: J92.3(DP0) L6.1 R357.2
HUB2_SSRX_N: L20.4 R352.1 ; off-sheet HUB2_SSRX_N
HUB2_SSRX_N_J25: J92.5(SSRXN0) L20.1 R352.2 U100.1(IO1) U100.10(NC_10)
HUB2_SSRX_P: L20.3 R354.1 ; off-sheet HUB2_SSRX_P
HUB2_SSRX_P_J25: J92.6(SSRXP0) L20.2 R354.2 U100.2(IO2) U100.9(NC_9)
HUB2_SSTX_N: L21.4 R353.1 ; off-sheet HUB2_SSTX_N
HUB2_SSTX_P: L21.3 R355.1 ; off-sheet HUB2_SSTX_P
NetR180_2: R180.2 U25.3(OC*)

### Notes on the sheet
- USB 3.0 TYPE A x2 CONNECTOR (1 OF 2)
- (in symbol radxa_1010) Size; Title:; REV; Page Name:; Date:; Sheet; of
- (in symbol USB3D0_2) USB3_TYPE_A_TOP; USB2; USB3; USB3_TYPE_A_BOTTOM

### Library data of the parts
C74 = C: SMD  0603  4.7UF  16V  X5R  ±10%  ROHS; PARTS: 1; Part Reference: C74; Part Number: A1C01.00239; OriginalSymbolOrigin: (0,30); PKG_TYPE: CAP2-100-250; LEVEL: STD; PINSWAP: (A,B); Value: 4.7UF 16V; Part Type: 陶瓷电容; PCB Footprint: C0603
C152 = C: SMD  0603  22UF  10V  X5R  ±10%  ROHS; PARTS: 1; Part Reference: C152; Part Number: A1C01.00296; OriginalSymbolOrigin: (0,30); PKG_TYPE: CAP2-100-250; LEVEL: STD; PINSWAP: (A,B); Value: 22UF 10V; Part Type: 陶瓷电容; PCB Footprint: C0603
J92 = USB3D0_2: DIP  USB3.0母座  双层  卷边无定位柱  蓝色胶芯  17.5*14.5*H15.5mm  90度弯脚  弯脚固定间距15.6mm  不锈钢  WLUS-096H  兆联  ROHS; Part Reference: J92; Part Number: A1J08.00040; OriginalSymbolOrigin: (-300,1100); SKU: COMMON; SHROUDED: ?; SHIELDED: ?; REFLOW: ?; PLACEMENT_NOTE: ?; PITCH: ?; PATH: ?; PACK_TYPE: ?; NV_PN: ?; NV_NAME: ?; MAX_VOLTAGE: ?; MAX_CURRENT: ?; LATCHING: ?; GENDER: ?; EMI_GROUND_TAB: ?; ASSEMBLY: ?; ANGLE: ?; Value: USB3D0_2; Part Type: USB座; PCB Footprint: USB3_TH18_17D0X14D0_LIE
L5 = MCZ1210AH900L2: SMD  MCZ1210AH900L2TA0G  90R  4PIN  TDK  ROHS; Part Reference: L5; Part Number: A1L03.00007; PCB Footprint: LC1210; Value: MCZ1210AH900L2; Part Type: 共模电感
L6 = MCZ1210AH900L2: SMD  MCZ1210AH900L2TA0G  90R  4PIN  TDK  ROHS; Part Reference: L6; Part Number: A1L03.00007; PCB Footprint: LC1210; Value: MCZ1210AH900L2; Part Type: 共模电感
L20 = MCZ1210AH900L2: SMD  MCZ1210AH900L2TA0G  90R  4PIN  TDK  ROHS; Part Reference: L20; Part Number: A1L03.00007; PCB Footprint: LC1210; Value: MCZ1210AH900L2; Part Type: 共模电感
L21 = MCZ1210AH900L2: SMD  MCZ1210AH900L2TA0G  90R  4PIN  TDK  ROHS; Part Reference: L21; Part Number: A1L03.00007; PCB Footprint: LC1210; Value: MCZ1210AH900L2; Part Type: 共模电感
L22 = MCZ1210AH900L2: SMD  MCZ1210AH900L2TA0G  90R  4PIN  TDK  ROHS; Part Reference: L22; Part Number: A1L03.00007; PCB Footprint: LC1210; Value: MCZ1210AH900L2; Part Type: 共模电感
L23 = MCZ1210AH900L2: SMD  MCZ1210AH900L2TA0G  90R  4PIN  TDK  ROHS; Part Reference: L23; Part Number: A1L03.00007; PCB Footprint: LC1210; Value: MCZ1210AH900L2; Part Type: 共模电感
R90 = R: SMD  0402  10K  1/16W  ±1%  ROHS; Part Reference: R90; CDS_PHYS_PART_NAME: R_0402-10K,5 %,62.5MW,195-0486-000-10K,195-0486-000; CDS_PART_NAME: R_0402-10K,5 %,62.5MW,195-0486-000; Part Number: A1R01.00222; SEC: 1; XY: (-7750,6150); VER: 2; TOL: 5%; SIGNAL_MODEL: nv_res; ROT: 0; PHYS_PAGE: 14; PATH: I42; PACK_TYPE: 402; NV_PN: 195-0486-000; MAX_WATTAGE: 62.5mW; DRAWING: #NAME?; DEVICE_TYPENAME: R_0402-10K5625MW195-0486-000-10K195-0486-000; CDS_LIB: discrete; ASSEMBLY: USB3_TYPEA; PCB Footprint: R0402; Value: 10K 1%; CHIPS_PART_NAME: R; CDS_SEC: 1; Part Type: 贴片电阻
R180 = R: SMD  0402  3.4K  1/16W  ±1%  ROHS; Part Reference: R180; Part Number: A1R01.00506; PCB Footprint: R0402; Value: NC/3.4K 1%; Part Type: 贴片电阻
R346 = R: SMD  0402  0R  1/16W  ±1%  ROHS; Part Reference: R346; Part Number: A1R01.00219; PCB Footprint: R0402; Value: NC/0R 1%; Part Type: 贴片电阻
R347 = R: SMD  0402  0R  1/16W  ±1%  ROHS; Part Reference: R347; Part Number: A1R01.00219; PCB Footprint: R0402; Value: NC/0R 1%; Part Type: 贴片电阻
R348 = R: SMD  0402  0R  1/16W  ±1%  ROHS; Part Reference: R348; Part Number: A1R01.00219; PCB Footprint: R0402; Value: NC/0R 1%; Part Type: 贴片电阻
R349 = R: SMD  0402  0R  1/16W  ±1%  ROHS; Part Reference: R349; Part Number: A1R01.00219; PCB Footprint: R0402; Value: NC/0R 1%; Part Type: 贴片电阻
R350 = R: SMD  0402  0R  1/16W  ±1%  ROHS; Part Reference: R350; Part Number: A1R01.00219; PCB Footprint: R0402; Value: NC/0R 1%; Part Type: 贴片电阻
R351 = R: SMD  0402  0R  1/16W  ±1%  ROHS; Part Reference: R351; Part Number: A1R01.00219; PCB Footprint: R0402; Value: NC/0R 1%; Part Type: 贴片电阻
R352 = R: SMD  0402  0R  1/16W  ±1%  ROHS; Part Reference: R352; Part Number: A1R01.00219; PCB Footprint: R0402; Value: NC/0R 1%; Part Type: 贴片电阻
R353 = R: SMD  0402  0R  1/16W  ±1%  ROHS; Part Reference: R353; Part Number: A1R01.00219; PCB Footprint: R0402; Value: NC/0R 1%; Part Type: 贴片电阻
R354 = R: SMD  0402  0R  1/16W  ±1%  ROHS; Part Reference: R354; Part Number: A1R01.00219; PCB Footprint: R0402; Value: NC/0R 1%; Part Type: 贴片电阻
R355 = R: SMD  0402  0R  1/16W  ±1%  ROHS; Part Reference: R355; Part Number: A1R01.00219; PCB Footprint: R0402; Value: NC/0R 1%; Part Type: 贴片电阻
R356 = R: SMD  0402  0R  1/16W  ±1%  ROHS; Part Reference: R356; Part Number: A1R01.00219; PCB Footprint: R0402; Value: NC/0R 1%; Part Type: 贴片电阻
R357 = R: SMD  0402  0R  1/16W  ±1%  ROHS; Part Reference: R357; Part Number: A1R01.00219; PCB Footprint: R0402; Value: NC/0R 1%; Part Type: 贴片电阻
U25 = AP22811AW5-7: SMD  功率电子开关  AP22811AW5-7  2A;2.7V~5.5V,Active High  SOT23_5  DIODES(美台)  ROHS; Part Reference: U25; Part Number: A1I01.00763; OriginalSymbolOrigin: (-250,250); Temp Coeff: -40℃~85℃; ASSEMBLY: ?; MAX_CURRENT: ?; MAX_VOLTAGE: ?; NV_NAME: ?; NV_PN: ?; OUTPUT_VOLTAGE: ?; PACK_TYPE: ?; PATH: ?; PLACEMENT_NOTE: ?; SKU: COMMON; TYPE: ?; Value: AP22811AW5-7; Part Type: 集成电路/模块; PCB Footprint: SOT23_5
U100 = ESD73034D: SMD  编带  SON10  ESD73034D-10/TR  4Line 双向TVS  VRWM=3.3V  0.2pF  33W  WILLSEMI(韦尔)  ROHS; Part Reference: U100; Part Number: A1D02.00015; Parameter: ESD-ESD73034D-封装 SON10_2R50X1R00X0R50; PCB Footprint: XSON10_0D5_1D1X2D6; Value: ESD73034D; Part Type: 二极管-ESD管-桥堆-TVS管
U101 = ESD73034D: SMD  编带  SON10  ESD73034D-10/TR  4Line 双向TVS  VRWM=3.3V  0.2pF  33W  WILLSEMI(韦尔)  ROHS; Part Reference: U101; Part Number: A1D02.00015; Parameter: ESD-ESD73034D-封装 SON10_2R50X1R00X0R50; PCB Footprint: XSON10_0D5_1D1X2D6; Value: ESD73034D; Part Type: 二极管-ESD管-桥堆-TVS管
*#11 = radxa_1010: Page Create Date: March  8, 1995; Page Size: =PageSize; Page Modify Date: =ModifiedDate

## Sheet 13_USB3.1 Type-A x2 (B).SchDoc: C200
size 439 x 311 mm; Page Create Date: March  8, 1995; Page Number: 13; Page Size: Custom; Comment: radxa_1010; Page Count: 21; RevCode: V1.11; Doc: 13_USB3.1 Type-A x2 (B); DsnPath: D:\WMS\C200\CC122\对外\C200 V1.11.DSN; SchematicName: c200; PageName: 13_USB3.1 Type-A x2 (B); PageSize: Custom; TopSchematic: True
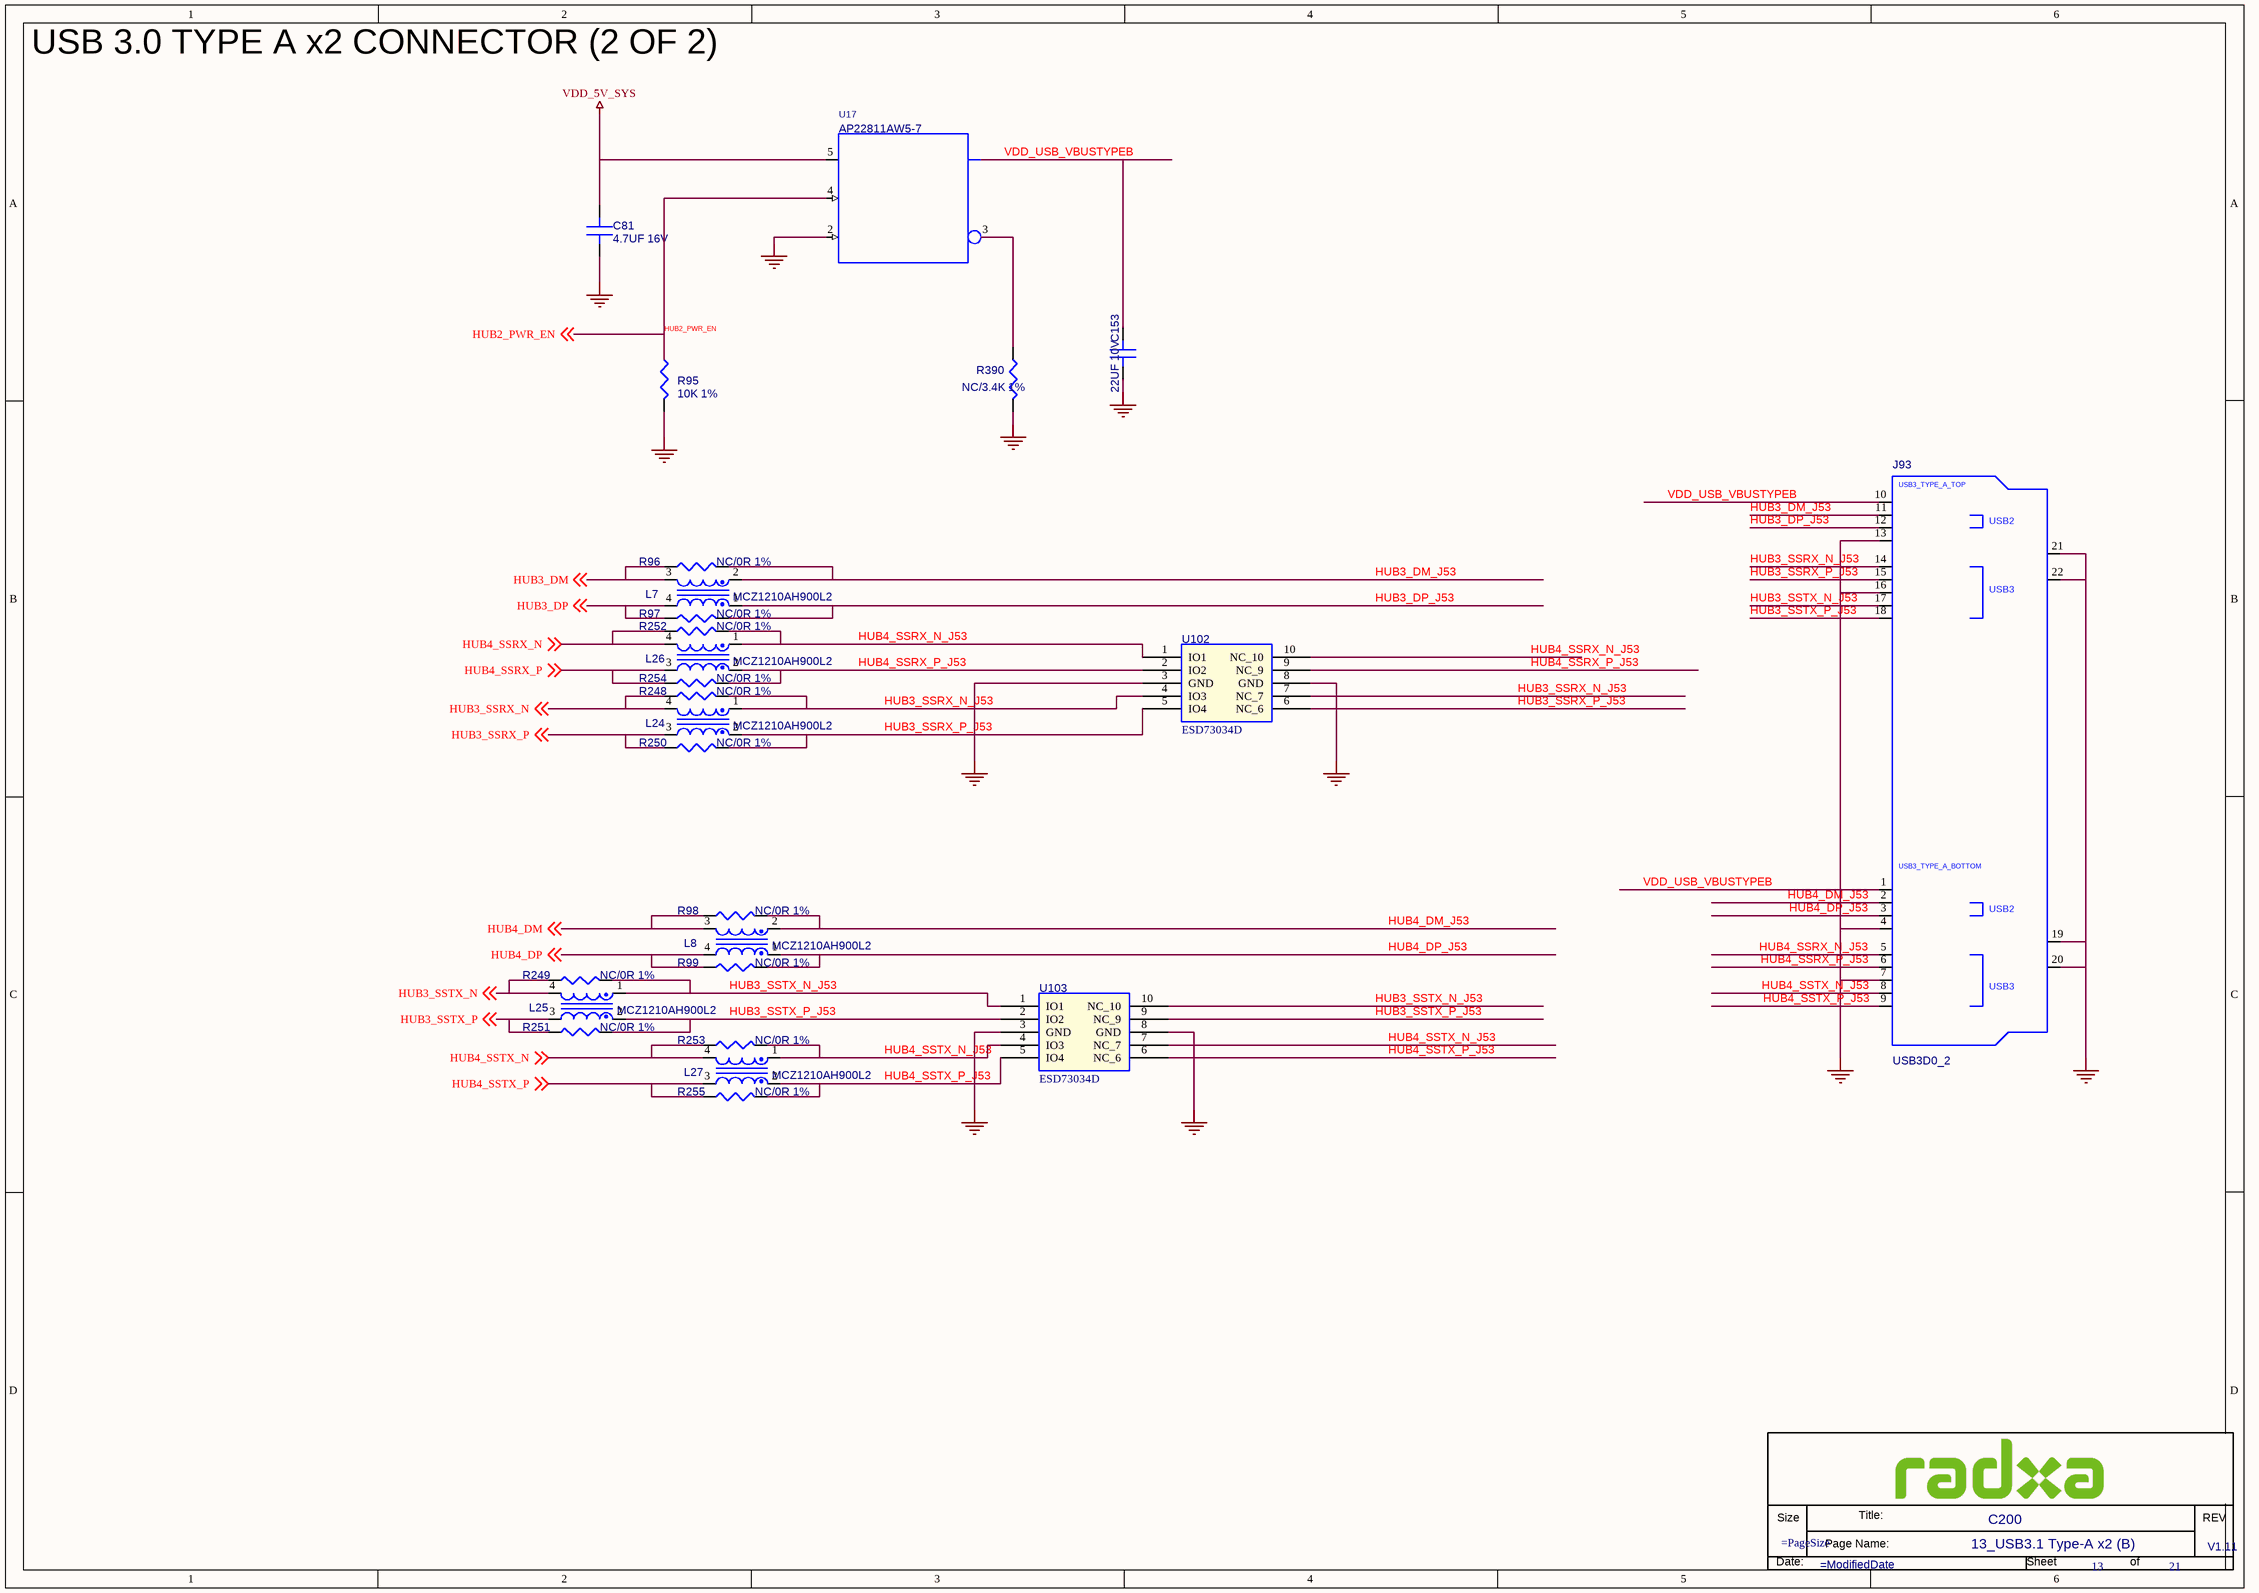
[diagram p25: 13_USB3.1 Type-A x2 (B).SchDoc]

### Parts
(Parts that share a designator on the sheet are numbered #1, #2 ... from top to bottom, then left to right.)
*#12  Doc: 13_USB3.1 Type-A x2 (B)  RevCode: V1.11  Title: C200  Page Number: 13  Page Count: 21  (hidden comment: radxa_1010)  (graphical)
C81  4.7UF 16V  [C0603]
C153  22UF 10V  [C0603]
J93  USB3D0_2  [USB3_TH18_17D0X14D0_LIE]
L7  MCZ1210AH900L2  [LC1210]
L8  MCZ1210AH900L2  [LC1210]
L24  MCZ1210AH900L2  [LC1210]
L25  MCZ1210AH900L2  [LC1210]
L26  MCZ1210AH900L2  [LC1210]
L27  MCZ1210AH900L2  [LC1210]
R95  10K 1%  [R0402]
R96  NC/0R 1%  [R0402]
R97  NC/0R 1%  [R0402]
R98  NC/0R 1%  [R0402]
R99  NC/0R 1%  [R0402]
R248  NC/0R 1%  [R0402]
R249  NC/0R 1%  [R0402]
R250  NC/0R 1%  [R0402]
R251  NC/0R 1%  [R0402]
R252  NC/0R 1%  [R0402]
R253  NC/0R 1%  [R0402]
R254  NC/0R 1%  [R0402]
R255  NC/0R 1%  [R0402]
R390  NC/3.4K 1%  [R0402]
U17  AP22811AW5-7  [SOT23_5]
U102  ESD73034D  [XSON10_0D5_1D1X2D6]
U103  ESD73034D  [XSON10_0D5_1D1X2D6]

### Nets
GND: C81.2(B) C153.2(B) J93.4(GND1) J93.7(GND2) J93.13(GND3) J93.16(GND4) J93.19(MT1) J93.20(MT2) J93.21(MT3) J93.22(MT4) R95.2 R390.1 U17.2(GND) U102.3(GND) U102.8(GND) U103.3(GND) U103.8(GND)  [project net HUB2_SSTX_N_J25]
OUT: U17.1(OUT)
VDD_5V_SYS: C81.1(A) U17.5(IN)  [project net PC_LED+]
HUB2_PWR_EN: R95.1 U17.4(EN) ; off-sheet HUB2_PWR_EN
HUB3_DM: L7.3 R96.1 ; off-sheet HUB3_DM
HUB3_DM_J53: J93.11(DN1) L7.2 R96.2
HUB3_DP: L7.4 R97.1 ; off-sheet HUB3_DP
HUB3_DP_J53: J93.12(DP1) L7.1 R97.2
HUB3_SSRX_N: L24.4 R248.1 ; off-sheet HUB3_SSRX_N
HUB3_SSRX_N_J53: J93.14(SSRXN1) L24.1 R248.2 U102.4(IO3) U102.7(NC_7)
HUB3_SSRX_P: L24.3 R250.1 ; off-sheet HUB3_SSRX_P
HUB3_SSRX_P_J53: J93.15(SSRXP1) L24.2 R250.2 U102.5(IO4) U102.6(NC_6)
HUB3_SSTX_N: L25.4 R249.1 ; off-sheet HUB3_SSTX_N
HUB3_SSTX_N_J53: J93.17(SSTXN1) L25.1 R249.2 U103.1(IO1) U103.10(NC_10)
HUB3_SSTX_P: L25.3 R251.1 ; off-sheet HUB3_SSTX_P
HUB3_SSTX_P_J53: J93.18(SSTXP1) L25.2 R251.2 U103.2(IO2) U103.9(NC_9)
HUB4_DM: L8.3 R98.1 ; off-sheet HUB4_DM
HUB4_DM_J53: J93.2(DN0) L8.2 R98.2
HUB4_DP: L8.4 R99.1 ; off-sheet HUB4_DP
HUB4_DP_J53: J93.3(DP0) L8.1 R99.2
HUB4_SSRX_N: L26.4 R252.1 ; off-sheet HUB4_SSRX_N
HUB4_SSRX_N_J53: J93.5(SSRXN0) L26.1 R252.2 U102.1(IO1) U102.10(NC_10)
HUB4_SSRX_P: L26.3 R254.1 ; off-sheet HUB4_SSRX_P
HUB4_SSRX_P_J53: J93.6(SSRXP0) L26.2 R254.2 U102.2(IO2) U102.9(NC_9)
HUB4_SSTX_N: L27.4 R253.1 ; off-sheet HUB4_SSTX_N
HUB4_SSTX_N_J53: J93.8(SSTXN0) L27.1 R253.2 U103.4(IO3) U103.7(NC_7)
HUB4_SSTX_P: L27.3 R255.1 ; off-sheet HUB4_SSTX_P
HUB4_SSTX_P_J53: J93.9(SSTXP0) L27.2 R255.2 U103.5(IO4) U103.6(NC_6)
VDD_USB_VBUSTYPEB: C153.1(A) J93.1(VBUS0) J93.10(VBUS1)
NetR390_2: R390.2 U17.3(OC*)

### Notes on the sheet
- USB 3.0 TYPE A x2 CONNECTOR (2 OF 2)
- (in symbol radxa_1010) Size; Title:; REV; Page Name:; Date:; Sheet; of
- (in symbol USB3D0_2) USB3_TYPE_A_TOP; USB2; USB3; USB3_TYPE_A_BOTTOM

### Library data of the parts
C81 = C: SMD  0603  4.7UF  16V  X5R  ±10%  ROHS; PARTS: 1; Part Reference: C81; Part Number: A1C01.00239; OriginalSymbolOrigin: (0,30); PKG_TYPE: CAP2-100-250; LEVEL: STD; PINSWAP: (A,B); Value: 4.7UF 16V; Part Type: 陶瓷电容; PCB Footprint: C0603
C153 = C: SMD  0603  22UF  10V  X5R  ±10%  ROHS; PARTS: 1; Part Reference: C153; Part Number: A1C01.00296; OriginalSymbolOrigin: (0,30); PKG_TYPE: CAP2-100-250; LEVEL: STD; PINSWAP: (A,B); Value: 22UF 10V; Part Type: 陶瓷电容; PCB Footprint: C0603
J93 = USB3D0_2: DIP  USB3.0母座  双层  卷边无定位柱  蓝色胶芯  17.5*14.5*H15.5mm  90度弯脚  弯脚固定间距15.6mm  不锈钢  WLUS-096H  兆联  ROHS; Part Reference: J93; Part Number: A1J08.00040; OriginalSymbolOrigin: (-300,1100); SKU: COMMON; SHROUDED: ?; SHIELDED: ?; REFLOW: ?; PLACEMENT_NOTE: ?; PITCH: ?; PATH: ?; PACK_TYPE: ?; NV_PN: ?; NV_NAME: ?; MAX_VOLTAGE: ?; MAX_CURRENT: ?; LATCHING: ?; GENDER: ?; EMI_GROUND_TAB: ?; ASSEMBLY: ?; ANGLE: ?; Value: USB3D0_2; Part Type: USB座; PCB Footprint: USB3_TH18_17D0X14D0_LIE
L7 = MCZ1210AH900L2: SMD  MCZ1210AH900L2TA0G  90R  4PIN  TDK  ROHS; Part Reference: L7; Part Number: A1L03.00007; PCB Footprint: LC1210; Value: MCZ1210AH900L2; Part Type: 共模电感
L8 = MCZ1210AH900L2: SMD  MCZ1210AH900L2TA0G  90R  4PIN  TDK  ROHS; Part Reference: L8; Part Number: A1L03.00007; PCB Footprint: LC1210; Value: MCZ1210AH900L2; Part Type: 共模电感
L24 = MCZ1210AH900L2: SMD  MCZ1210AH900L2TA0G  90R  4PIN  TDK  ROHS; Part Reference: L24; Part Number: A1L03.00007; PCB Footprint: LC1210; Value: MCZ1210AH900L2; Part Type: 共模电感
L25 = MCZ1210AH900L2: SMD  MCZ1210AH900L2TA0G  90R  4PIN  TDK  ROHS; Part Reference: L25; Part Number: A1L03.00007; PCB Footprint: LC1210; Value: MCZ1210AH900L2; Part Type: 共模电感
L26 = MCZ1210AH900L2: SMD  MCZ1210AH900L2TA0G  90R  4PIN  TDK  ROHS; Part Reference: L26; Part Number: A1L03.00007; PCB Footprint: LC1210; Value: MCZ1210AH900L2; Part Type: 共模电感
L27 = MCZ1210AH900L2: SMD  MCZ1210AH900L2TA0G  90R  4PIN  TDK  ROHS; Part Reference: L27; Part Number: A1L03.00007; PCB Footprint: LC1210; Value: MCZ1210AH900L2; Part Type: 共模电感
R95 = R: SMD  0402  10K  1/16W  ±1%  ROHS; Part Reference: R95; CDS_PHYS_PART_NAME: R_0402-10K,5 %,62.5MW,195-0486-000-10K,195-0486-000; CDS_PART_NAME: R_0402-10K,5 %,62.5MW,195-0486-000; Part Number: A1R01.00222; SEC: 1; XY: (-7750,6150); VER: 2; TOL: 5%; SIGNAL_MODEL: nv_res; ROT: 0; PHYS_PAGE: 14; PATH: I42; PACK_TYPE: 402; NV_PN: 195-0486-000; MAX_WATTAGE: 62.5mW; DRAWING: #NAME?; DEVICE_TYPENAME: R_0402-10K5625MW195-0486-000-10K195-0486-000; CDS_LIB: discrete; ASSEMBLY: USB3_TYPEA; PCB Footprint: R0402; Value: 10K 1%; CHIPS_PART_NAME: R; CDS_SEC: 1; Part Type: 贴片电阻
R96 = R: SMD  0402  0R  1/16W  ±1%  ROHS; Part Reference: R96; Part Number: A1R01.00219; PCB Footprint: R0402; Value: NC/0R 1%; Part Type: 贴片电阻
R97 = R: SMD  0402  0R  1/16W  ±1%  ROHS; Part Reference: R97; Part Number: A1R01.00219; PCB Footprint: R0402; Value: NC/0R 1%; Part Type: 贴片电阻
R98 = R: SMD  0402  0R  1/16W  ±1%  ROHS; Part Reference: R98; Part Number: A1R01.00219; PCB Footprint: R0402; Value: NC/0R 1%; Part Type: 贴片电阻
R99 = R: SMD  0402  0R  1/16W  ±1%  ROHS; Part Reference: R99; Part Number: A1R01.00219; PCB Footprint: R0402; Value: NC/0R 1%; Part Type: 贴片电阻
R248 = R: SMD  0402  0R  1/16W  ±1%  ROHS; Part Reference: R248; Part Number: A1R01.00219; PCB Footprint: R0402; Value: NC/0R 1%; Part Type: 贴片电阻
R249 = R: SMD  0402  0R  1/16W  ±1%  ROHS; Part Reference: R249; Part Number: A1R01.00219; PCB Footprint: R0402; Value: NC/0R 1%; Part Type: 贴片电阻
R250 = R: SMD  0402  0R  1/16W  ±1%  ROHS; Part Reference: R250; Part Number: A1R01.00219; PCB Footprint: R0402; Value: NC/0R 1%; Part Type: 贴片电阻
R251 = R: SMD  0402  0R  1/16W  ±1%  ROHS; Part Reference: R251; Part Number: A1R01.00219; PCB Footprint: R0402; Value: NC/0R 1%; Part Type: 贴片电阻
R252 = R: SMD  0402  0R  1/16W  ±1%  ROHS; Part Reference: R252; Part Number: A1R01.00219; PCB Footprint: R0402; Value: NC/0R 1%; Part Type: 贴片电阻
R253 = R: SMD  0402  0R  1/16W  ±1%  ROHS; Part Reference: R253; Part Number: A1R01.00219; PCB Footprint: R0402; Value: NC/0R 1%; Part Type: 贴片电阻
R254 = R: SMD  0402  0R  1/16W  ±1%  ROHS; Part Reference: R254; Part Number: A1R01.00219; PCB Footprint: R0402; Value: NC/0R 1%; Part Type: 贴片电阻
R255 = R: SMD  0402  0R  1/16W  ±1%  ROHS; Part Reference: R255; Part Number: A1R01.00219; PCB Footprint: R0402; Value: NC/0R 1%; Part Type: 贴片电阻
R390 = R: SMD  0402  3.4K  1/16W  ±1%  ROHS; Part Reference: R390; Part Number: A1R01.00506; PCB Footprint: R0402; Value: NC/3.4K 1%; Part Type: 贴片电阻
U17 = AP22811AW5-7: SMD  功率电子开关  AP22811AW5-7  2A;2.7V~5.5V,Active High  SOT23_5  DIODES(美台)  ROHS; Part Reference: U17; Part Number: A1I01.00763; OriginalSymbolOrigin: (-250,250); Temp Coeff: -40℃~85℃; ASSEMBLY: ?; MAX_CURRENT: ?; MAX_VOLTAGE: ?; NV_NAME: ?; NV_PN: ?; OUTPUT_VOLTAGE: ?; PACK_TYPE: ?; PATH: ?; PLACEMENT_NOTE: ?; SKU: COMMON; TYPE: ?; Value: AP22811AW5-7; Part Type: 集成电路/模块; PCB Footprint: SOT23_5
U102 = ESD73034D: SMD  编带  SON10  ESD73034D-10/TR  4Line 双向TVS  VRWM=3.3V  0.2pF  33W  WILLSEMI(韦尔)  ROHS; Part Reference: U102; Part Number: A1D02.00015; Parameter: ESD-ESD73034D-封装 SON10_2R50X1R00X0R50; PCB Footprint: XSON10_0D5_1D1X2D6; Value: ESD73034D; Part Type: 二极管-ESD管-桥堆-TVS管
U103 = ESD73034D: SMD  编带  SON10  ESD73034D-10/TR  4Line 双向TVS  VRWM=3.3V  0.2pF  33W  WILLSEMI(韦尔)  ROHS; Part Reference: U103; Part Number: A1D02.00015; Parameter: ESD-ESD73034D-封装 SON10_2R50X1R00X0R50; PCB Footprint: XSON10_0D5_1D1X2D6; Value: ESD73034D; Part Type: 二极管-ESD管-桥堆-TVS管
*#12 = radxa_1010: Page Create Date: March  8, 1995; Page Size: =PageSize; Page Modify Date: =ModifiedDate